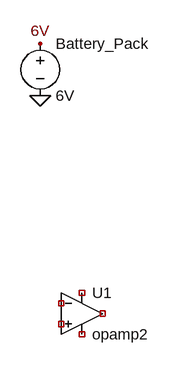
[diagram p0: schematic DC - Circuit.asc]
DC - Circuit.asc, the LTspice schematic file:
Version 4.1
SHEET 1 880 680
FLAG 16 160 0
FLAG 16 80 6V
SYMBOL voltage 16 64 R0
SYMATTR InstName Battery_Pack
SYMATTR Value 6V
SYMBOL OpAmps\\opamp2 80 432 R0
SYMATTR InstName U1

The netlist it stands for:
* DC - Circuit.asc
V§Battery_Pack 6V 0 6V
X§U1 NC_01 NC_02 NC_03 NC_04 NC_05 opamp2  ; pins In+ In- V+ V- OUT
.backanno
.end